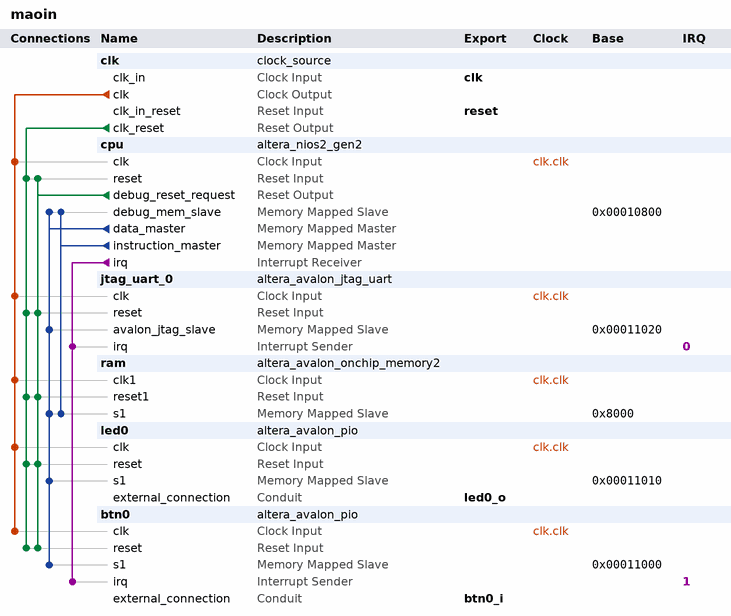
[diagram p0: system contents]
# Platform Designer (Qsys) system maoin, MAX 10 10M50DAF484C7G
# Parameters at their usual value, and those the tool derives, are not listed.
package require -exact qsys 18.1
create_system maoin
set_project_property DEVICE_FAMILY {MAX 10}
set_project_property DEVICE 10M50DAF484C7G

add_instance clk clock_source 18.1
set_instance_parameter_value clk clockFrequency 50000000

add_instance cpu altera_nios2_gen2 18.1
set_instance_parameter_value cpu dcache_size 2048
set_instance_parameter_value cpu exceptionSlave ram.s1
set_instance_parameter_value cpu icache_size 4096
set_instance_parameter_value cpu impl Tiny
set_instance_parameter_value cpu resetSlave ram.s1

add_instance jtag_uart_0 altera_avalon_jtag_uart 18.1
set_instance_parameter_value jtag_uart_0 simInteractiveOptions NO_INTERACTIVE_WINDOWS

add_instance ram altera_avalon_onchip_memory2 18.1
set_instance_parameter_value ram dataWidth 32
set_instance_parameter_value ram dualPort false
set_instance_parameter_value ram initMemContent false
set_instance_parameter_value ram initializationFileName onchip_mem.hex
set_instance_parameter_value ram memorySize 20096

add_instance led0 altera_avalon_pio 18.1
set_instance_parameter_value led0 direction Output
set_instance_parameter_value led0 width 8

add_instance btn0 altera_avalon_pio 18.1
set_instance_parameter_value btn0 bitClearingEdgeCapReg true
set_instance_parameter_value btn0 captureEdge true
set_instance_parameter_value btn0 direction Input
set_instance_parameter_value btn0 generateIRQ true
set_instance_parameter_value btn0 irqType EDGE
set_instance_parameter_value btn0 simDoTestBenchWiring true
set_instance_parameter_value btn0 width 1

# connections
add_connection clk.clk btn0.clk clock
add_connection clk.clk cpu.clk clock
add_connection clk.clk jtag_uart_0.clk clock
add_connection clk.clk led0.clk clock
add_connection clk.clk ram.clk1 clock
add_connection clk.clk_reset btn0.reset reset
add_connection clk.clk_reset cpu.reset reset
add_connection clk.clk_reset jtag_uart_0.reset reset
add_connection clk.clk_reset led0.reset reset
add_connection clk.clk_reset ram.reset1 reset
add_connection cpu.debug_reset_request btn0.reset reset
add_connection cpu.debug_reset_request cpu.reset reset
add_connection cpu.debug_reset_request jtag_uart_0.reset reset
add_connection cpu.debug_reset_request led0.reset reset
add_connection cpu.debug_reset_request ram.reset1 reset
add_connection cpu.data_master btn0.s1 avalon
set_connection_parameter_value cpu.data_master/btn0.s1 baseAddress 0x00011000
add_connection cpu.data_master cpu.debug_mem_slave avalon
set_connection_parameter_value cpu.data_master/cpu.debug_mem_slave baseAddress 0x00010800
add_connection cpu.data_master jtag_uart_0.avalon_jtag_slave avalon
set_connection_parameter_value cpu.data_master/jtag_uart_0.avalon_jtag_slave baseAddress 0x00011020
add_connection cpu.data_master led0.s1 avalon
set_connection_parameter_value cpu.data_master/led0.s1 baseAddress 0x00011010
add_connection cpu.data_master ram.s1 avalon
set_connection_parameter_value cpu.data_master/ram.s1 baseAddress 0x8000
add_connection cpu.instruction_master cpu.debug_mem_slave avalon
set_connection_parameter_value cpu.instruction_master/cpu.debug_mem_slave baseAddress 0x00010800
add_connection cpu.instruction_master ram.s1 avalon
set_connection_parameter_value cpu.instruction_master/ram.s1 baseAddress 0x8000
add_connection cpu.irq btn0.irq interrupt
set_connection_parameter_value cpu.irq/btn0.irq irqNumber 1
add_connection cpu.irq jtag_uart_0.irq interrupt
set_connection_parameter_value cpu.irq/jtag_uart_0.irq irqNumber 0

# exported interfaces
add_interface btn0_i conduit end
set_interface_property btn0_i EXPORT_OF btn0.external_connection
add_interface clk clock sink
set_interface_property clk EXPORT_OF clk.clk_in
add_interface led0_o conduit end
set_interface_property led0_o EXPORT_OF led0.external_connection
add_interface reset reset sink
set_interface_property reset EXPORT_OF clk.clk_in_reset

set_interconnect_requirement {$system} qsys_mm.clockCrossingAdapter HANDSHAKE
set_interconnect_requirement {$system} qsys_mm.enableEccProtection FALSE
set_interconnect_requirement {$system} qsys_mm.insertDefaultSlave FALSE
set_interconnect_requirement {$system} qsys_mm.maxAdditionalLatency 1

save_system maoin.qsys
